# Altium schematic sheet Power-Section.SchDoc
size A4; DocumentNumber: 2; SheetNumber: 2; SheetTotal: 10
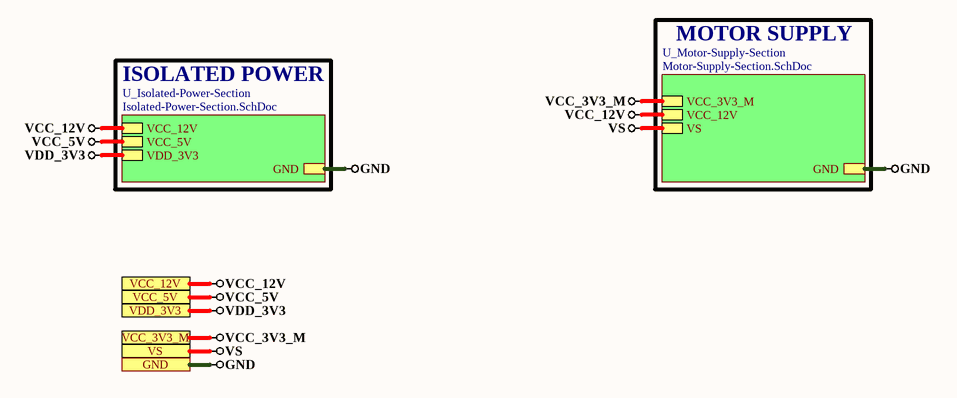
[diagram p0: Power-Section.SchDoc]

## Sub-sheets
U_Isolated-Power-Section = Isolated-Power-Section.SchDoc: GND, VCC_12V, VCC_5V, VDD_3V3
U_Motor-Supply-Section = Motor-Supply-Section.SchDoc: VCC_3V3_M, VCC_12V, GND, VS

## Ports
GND, VCC_3V3_M, VCC_5V, VCC_12V, VDD_3V3, VS

## Nets
GND: port GND, sheet U_Isolated-Power-Section/GND, sheet U_Motor-Supply-Section/GND
VCC_3V3_M: port VCC_3V3_M, sheet U_Motor-Supply-Section/VCC_3V3_M
VCC_5V: port VCC_5V, sheet U_Isolated-Power-Section/VCC_5V
VCC_12V: port VCC_12V, sheet U_Isolated-Power-Section/VCC_12V, sheet U_Motor-Supply-Section/VCC_12V
VDD_3V3: port VDD_3V3, sheet U_Isolated-Power-Section/VDD_3V3
VS: port VS, sheet U_Motor-Supply-Section/VS

## Notes on the sheet
- MOTOR SUPPLY
- ISOLATED POWER